# Altium schematic sheet Communications.SchDoc
size A
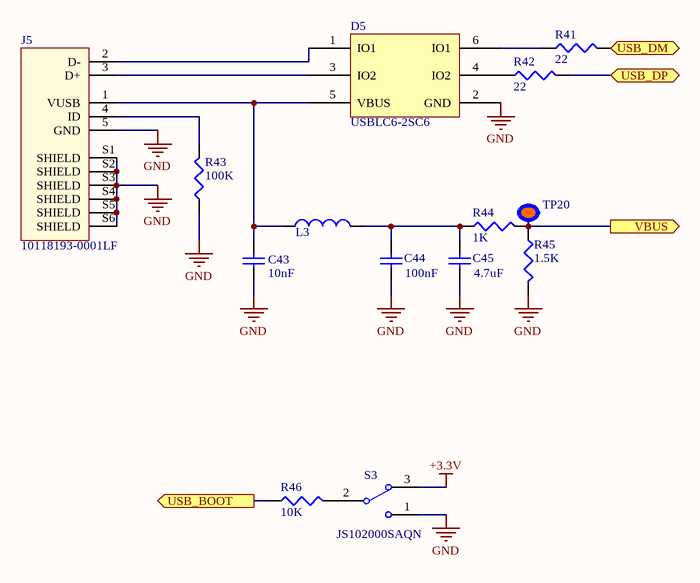
[diagram p0: Communications.SchDoc]

## Parts
C43  value 10nF  [RES_0603]  (hidden comment: CL10B103KB8NCNC)
C44  value 100nF  [RES_0603]  (hidden comment: 06035G104ZAT2A)
C45  value 4.7uF  [RES_0805]  (hidden comment: CL21A475KACLRNC)
D5  USBLC6-2SC6  [SOT23-6L]
J5  10118193-0001LF  [10118193-0001LF]
L3  BLM18PG221SZ1D  [RES_0603]  (value not drawn)
R41  value 22  [RES_0603]  (hidden comment: CRGCQ0603J22R)
R42  value 22  [RES_0603]  (hidden comment: CRGCQ0603J22R)
R43  value 100K  [RES_0603]  (hidden comment: RR0816P-104-D)
R44  value 1K  [RES_0603]  (hidden comment: RR0816P-102-D)
R45  value 1.5K  [RES_0603]  (hidden comment: A121524CT-ND)
R46  value 10K  [RES_0805]  (hidden comment: RR1220P-103-D)
S3  JS102000SAQN  [JS102011SAQN]
TP20  loop test point  [Test Point Mt Hole]  (value not drawn)

## Ports
USB_BOOT (out), USB_DM (bidir), USB_DP (bidir), VBUS (out)

## Nets
+3.3V: S3.3
GND: C43.1 C44.1 C45.1 D5.2(GND) J5.5(GND) J5.S1(SHIELD) J5.S2(SHIELD) J5.S3(SHIELD) J5.S4(SHIELD) J5.S5(SHIELD) J5.S6(SHIELD) R43.1 R45.2 S3.1
USB_BOOT: R46.1 ; port USB_BOOT
USB_DM: R41.2 ; port USB_DM
USB_DP: R42.2 ; port USB_DP
VBUS: R44.2 R45.1 TP20.1 ; port VBUS
NetC43_2: C43.2 D5.5(VBUS) J5.1(VUSB) L3.1
NetC44_2: C44.2 C45.2 L3.2 R44.1
NetD5_1: D5.1(IO1) J5.2(D-)
NetD5_3: D5.3(IO2) J5.3(D+)
NetD5_4: D5.4(IO2) R42.1
NetD5_6: D5.6(IO1) R41.1
NetJ5_4: J5.4(ID) R43.2
NetR46_2: R46.2 S3.2

## Library data of the parts
C43 C45 = Cap: Capacitor; Manufacturer: Samsung Electro-Mechanics; Supplier 1: Digi-Key
  C43: Manufacturer Part Number: CL10B103KB8NCNC; Supplier Part Number 1: 1276-1921-1-ND
  C45: Manufacturer Part Number: CL21A475KACLRNC; Supplier Part Number 1: 1276-2415-1-ND
C44 = Cap: Capacitor; Manufacturer: AVX Corporation; Manufacturer Part Number: 06035G104ZAT2A; Supplier 1: Digi-Key; Supplier Part Number 1: 478-3724-1-ND
D5 = USBLC6-2SC6: TVS DIODE 5.25V 17V SOT23-6; Manufacturer: STMicroelectronics; Supplier 1: Digi-Key; Supplier Part Number 1: 497-5235-1-ND; Manufacturer Part Number: USBLC6-2SC6
J5 = 10118193-0001LF: Single Port 5 Contact Shielded SMT MICRO USB B-Type Receptacle; Manufacturer: Amphenol ICC; Supplier 1: Digi-Key; Manufacturer Part Number: 10118193-0001LF; Supplier Part Number 1: 609-4616-1-ND
L3 = Inductor: Manufacturer: Murata Electronics; Value: 220 OHM; Manufacturer Part Number: BLM18PG221SZ1D; Supplier 1: Digi-Key; Supplier Part Number 1: 490-16588-1-ND
R41 R42 = Res3: Manufacturer: TE Connectivity Passive Product; Manufacturer Part Number: CRGCQ0603J22R; Supplier 1: Digi-Key; Supplier Part Number 1: A130081CT-ND
R43 R44 R46 = Res3: Resistor; Manufacturer: Susumu; Supplier 1: Digi-Key
  R43: Manufacturer Part Number: RR0816P-104-D; Supplier Part Number 1: RR08P100KDCT-ND
  R44: Manufacturer Part Number: RR0816P-102-D; Supplier Part Number 1: RR08P1.0KDDKR-ND
  R46: Manufacturer Part Number: RR1220P-103-D; Supplier Part Number 1: RR12P10.0KDCT-ND
R45 = Res3: Resistor; Manufacturer: TE Connectivity Passive Product; Manufacturer Part Number: A121524CT-ND; Supplier 1: Digi-Key; Supplier Part Number 1: CRG0603F1K5
S3 = SW-SPDT: SWITCH SLIDE SPDT 1MA 5V; Manufacturer: C&K; Supplier 1: Digi-Key; Supplier Part Number 1: 401-1999-1-ND; Manufacturer Part Number: JS102011SAQN
TP20 = 402046: Test Point Loop Miniature Keysone; Manufacturer: Keystone Electronics; Manufacturer Part Number: 5003; Supplier 1: Digi-Key; Supplier Part Number 1: 36-5003-ND